# EAGLE design rev1-dragonfly (EAGLE 8.2.2)
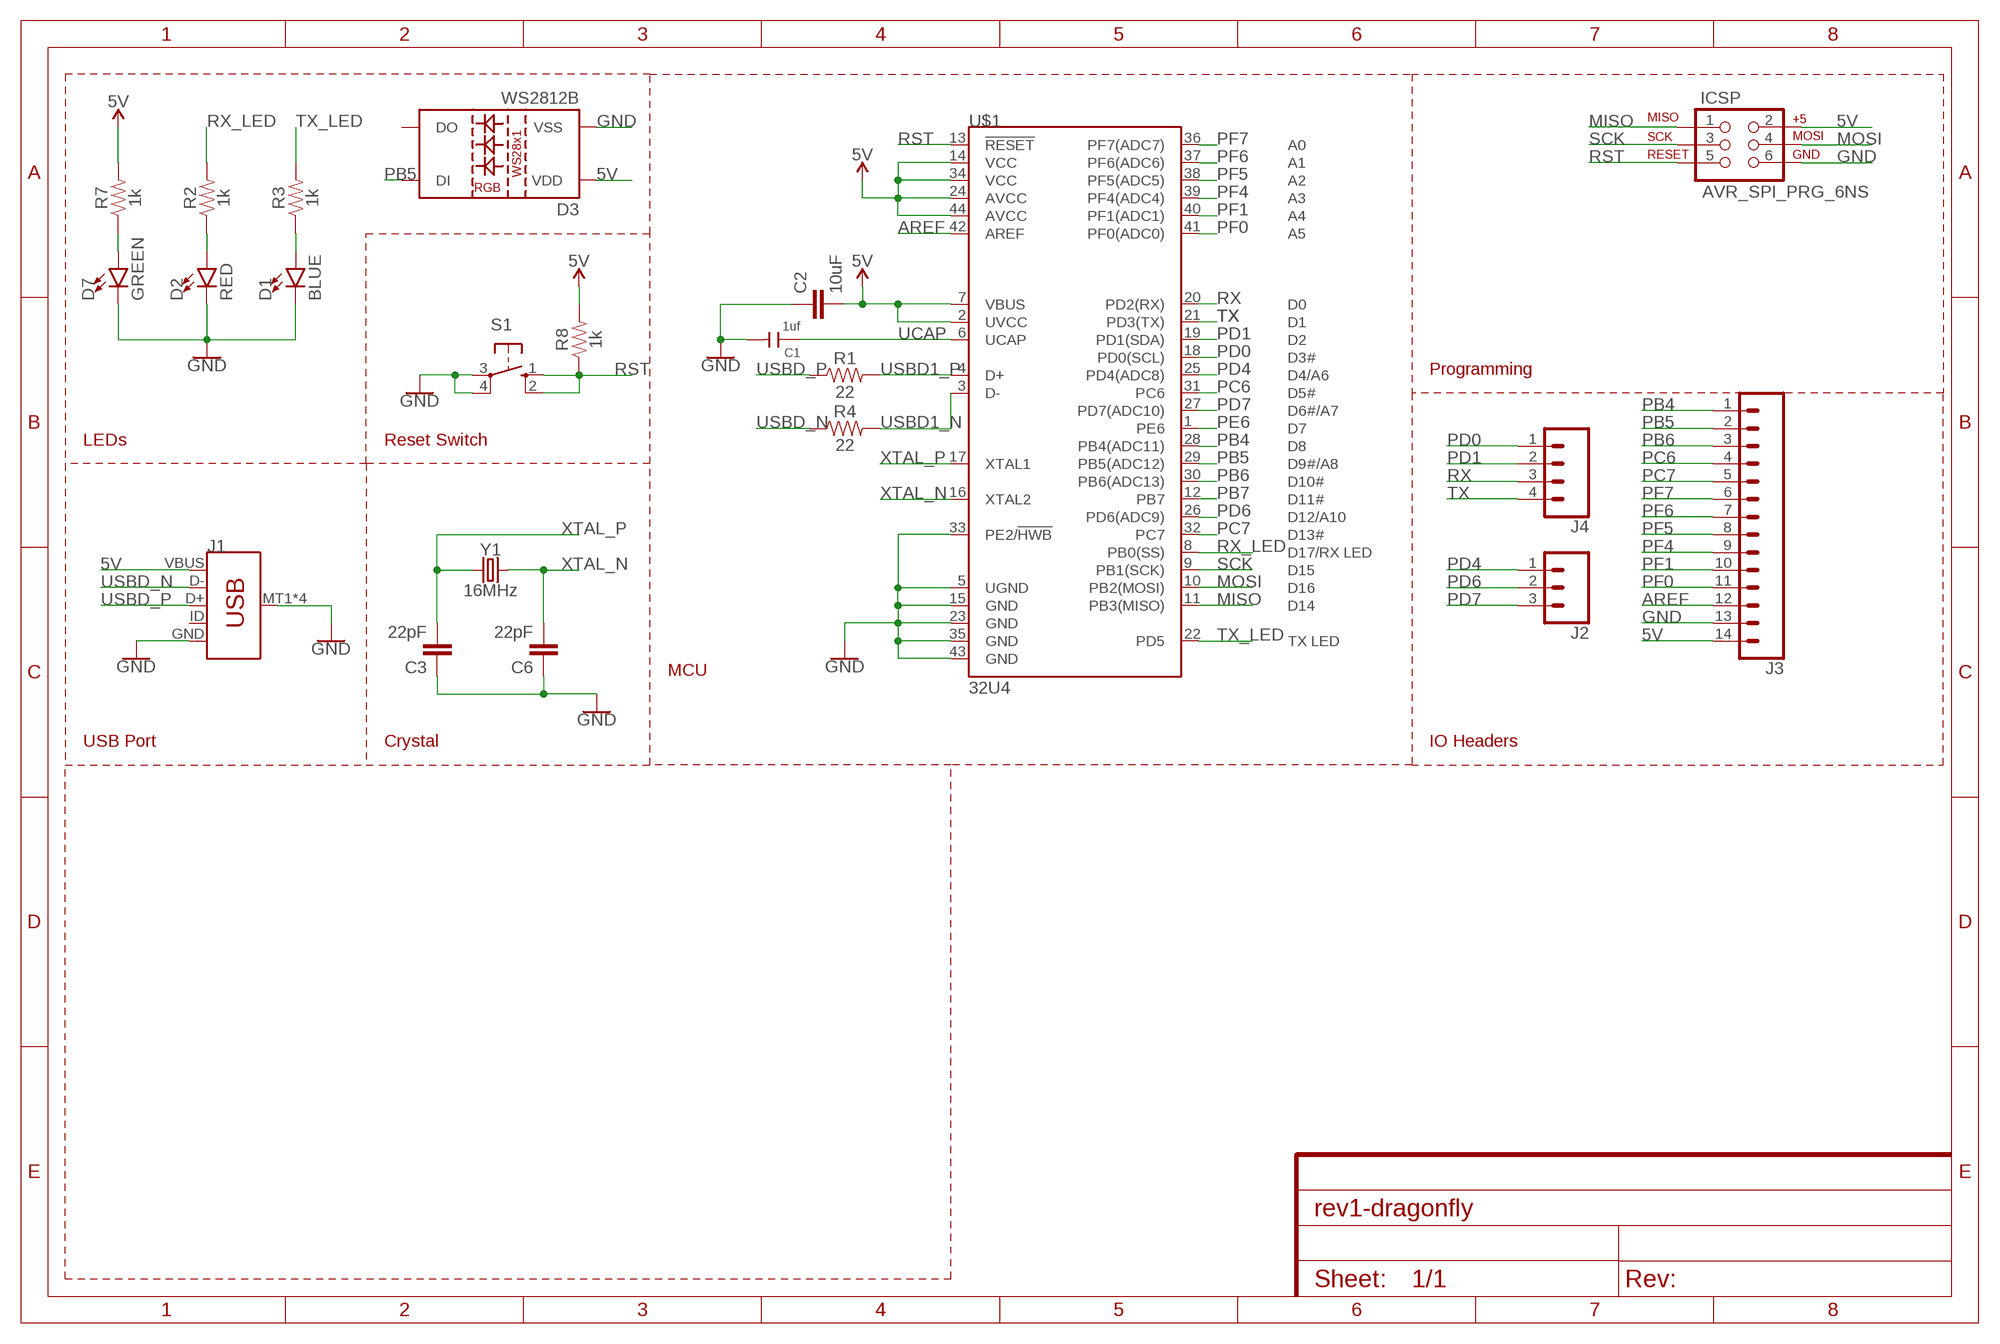
[diagram p0: schematic, sheet 1]

## Parts
C1  1uf  CERAMIC-1UF-25V-10%-X7R(0603)  [C0603]
C2  10uF  10UF-0805-10V-10%  [0805]
C3  22pF  22PF-0603-50V-5%  [0603]
C6  22pF  22PF-0603-50V-5%  [0603]
D1  BLUE  LED-BLUE0603  [LED-0603]
D2  RED  LED-RED0603  [LED-0603]
D3  WS2812B  [WS2812B]
D7  GREEN  LED-GREEN0603  [LED-0603]
ICSP  AVR_SPI_PRG_6NS  [2X3-NS]
J1  USB_MICRO-B_SMT  [USB-MICROB]
J2  CONN_03  [1X03]
J3  CONN_14  [1X14]
J4  CONN_04  [1X04]
R1  22  22OHM-0603-1/10W-1%  [0603]
R2  1k  RESISTOR0805  [0805]
R3  1k  RESISTOR0805  [0805]
R4  22  22OHM-0603-1/10W-1%  [0603]
R7  1k  RESISTOR0805  [0805]
R8  1k  RESISTOR0805  [0805]
S1  10-XX  [B3F-10XX]
U$1  32U4  ATMEGA32U4TQFP-44  [TQFP44]
Y1  16MHz  CRYSTAL-16MHZPTH-HC49US  [HC49US]

## Nets
5V [VCC]: C2.2 D3.1(VDD) ICSP.2 J1.VBUS J3.14 R7.2 R8.2 U$1.2(UVCC) U$1.7(VBUS) U$1.14(VCC) U$1.24(AVCC) U$1.34(VCC) U$1.44(AVCC)
AREF: J3.12 U$1.42(AREF)
GND [GND]: C1.2 C2.1 C3.1 C6.1 D1.C D2.C D3.3(VSS) D7.C ICSP.6 J1.GND J1.MT1(SHIELD) J1.MT2(SHIELD) J1.P$1(SHIELD) J1.P$2(SHIELD) J3.13 S1.3(P) S1.4(P1) U$1.5(UGND) U$1.15(GND) U$1.23(GND) U$1.33(PE2/!HWB) U$1.35(GND) U$1.43(GND)
MISO: ICSP.1 U$1.11(PB3(MISO))
MOSI: ICSP.4 U$1.10(PB2(MOSI))
N$1: D1.A R3.1
N$2: D2.A R2.1
N$3: D7.A R7.1
PB4: J3.1 U$1.28(PB4(ADC11))
PB5: D3.4(DI) J3.2 U$1.29(PB5(ADC12))
PB6: J3.3 U$1.30(PB6(ADC13))
PB7: U$1.12(PB7)
PC6: J3.4 U$1.31(PC6)
PC7: J3.5 U$1.32(PC7)
PD0: J4.1 U$1.18(PD0(SCL))
PD1: J4.2 U$1.19(PD1(SDA))
PD4: J2.1 U$1.25(PD4(ADC8))
PD6: J2.2 U$1.26(PD6(ADC9))
PD7: J2.3 U$1.27(PD7(ADC10))
PE6: U$1.1(PE6)
PF0: J3.11 U$1.41(PF0(ADC0))
PF1: J3.10 U$1.40(PF1(ADC1))
PF4: J3.9 U$1.39(PF4(ADC4))
PF5: J3.8 U$1.38(PF5(ADC5))
PF6: J3.7 U$1.37(PF6(ADC6))
PF7: J3.6 U$1.36(PF7(ADC7))
RST: ICSP.5 R8.1 S1.1(S) S1.2(S1) U$1.13(!RESET)
RX: J4.3 U$1.20(PD2(RX))
RX_LED: R2.2 U$1.8(PB0(SS))
SCK: ICSP.3 U$1.9(PB1(SCK))
TX: J4.4 U$1.21(PD3(TX))
TX_LED: R3.2 U$1.22(PD5)
UCAP: C1.1 U$1.6(UCAP)
USBD1_N: R4.2 U$1.3(D-)
USBD1_P: R1.2 U$1.4(D+)
USBD_N: J1.D- R4.1
USBD_P: J1.D+ R1.1
XTAL_N: C6.2 U$1.16(XTAL2) Y1.2
XTAL_P: C3.2 U$1.17(XTAL1) Y1.1
Unconnected: D3.2(DO) J1.ID

## Notes on the sheet
- Programming
- LEDs | Reset Switch
- MCU
- USB Port | Crystal | IO Headers

## Library data of the parts
C1 = Seeed-Capacitor:CERAMIC-1UF-25V-10%-X7R(0603): 302010139; MPN: CC0603KRX7R8BB105
C2 = SparkFun-Capacitors:10UF: 10.0µF ceramic capacitors A capacitor is a passive two-terminal electrical component used to store electrical energy temporarily in an electric field.; PROD_ID: CAP-11330
C3 C6 = SparkFun-Capacitors:22PF: 22pF ceramic capacitors A capacitor is a passive two-terminal electrical component used to store electrical energy temporarily in an electric field.; PROD_ID: CAP-07876
D1 = SparkFun-LED:LED-BLUE: Blue SMD LED Used in manufacturing of various products at SparkFun Packages: 0603 - SMD 0603 package [Product Link] <http://www.digikey.com/product-detail/en/SMLE12BC7TT86/511-1589-2-ND/1641808> 1206 - SMD1206 package [Product Link] <http://www.digikey.com/product-detail/en/lite-on-inc/LTST-C150TBKT/160-1643-1-ND/573584> SparkFun Products: ESP8266 Thing-Dev Board <https://www.sparkfun.com/products/13711> RedBoard <https://www.sparkfun.com/products/12757>; PROD_ID: DIO-08575
D2 = SparkFun-LED:LED-RED: Red SMD LED Used in manufacturing of most products at SparkFun Packages: 0603 - SMD 0603 package [Product Link] <http://docs.avagotech.com/docs/AV02-0551EN> 0603 SMART - SMD 0603 SMART package ( more efficient and expensive)[Product Link] <http://www.osram-os.com/Graphics/XPic2/00077099_0.pdf> 1206 - SMD1206 package [Product Link] <https://www.sparkfun.com/datasheets/DevTools/LilyPad/Q150OVS4.pdff> SparkFun Products: Pro Mini 328 -5V <https://www.sparkfun.com/products/821> RedBoard <https://www.sparkfun.com/products/12757> IOIO-OTG <https://www.sparkfun.com/products/13613>; PROD_ID: DIO-00819
D3 = SparkFun-LED:WS2812B: WS2812B SMD addressable RGB LED 5x5mm SMD LED with built-in controller IC. Color: Red/Green/Blue mC Rating: RGB: 390, 660, 180 mcd Forward Voltage: RGB: 2.0, 3.0, 3.0 V Packages:WS2812B SparkFun Products: Blynk Board - ESP8266 <https://www.sparkfun.com/products/13794>; PROD_ID: DIO-12503
D7 = SparkFun-LED:LED-GREEN: Green SMD LED Used in manufacturing of various products at SparkFun Packages: 0603 - SMD 0603 package [Product Link] <http://www.futureelectronics.com/en/technologies/semiconductors/optoelectronics/leds/Pages/9894312-LTST-C190GKT.aspx?CrossPart=HSMG-C190&IM=0> LilyPad 1206 - SMD1206 LilyPad package [Product Link] <http://www.futureelectronics.com/en/Technologies/Product.aspx?ProductID=IN150NGHARVATEKCORPORATION2049943&IM=0> 1206 - SMD1206 package [Product Link] <http://www.futureelectronics.com/en/technologies/semiconductors/optoelectronics/leds/Pages/8315665-LTST-C150KGKT.aspx?IM=0> 1206 Bottom Mount -SMD 1206 Bottom Mount [Product Link] <http://www.digikey.com/product-detail/en/lite-on-inc/LTST-C230KGKT/160-1456-1-ND/386854> SparkFun Products: Pro Mini 328 -5V <https://www.sparkfun.com/products/821> RedBoard <https://www.sparkfun.com/products/12757> MP3 Trigger <https://www.sparkfun.com/products/13720> Makey Makey <https://www.sparkfun.com/products/11076>; PROD_ID: DIO-00821
ICSP = SparkFun-Connectors:AVR_SPI_PRG_6: AVR ISP 6 Pin This is the reduced ISP connector for AVR programming. Common on Arduino. This footprint will take up less PCB space and can be used with a 10-pin to 6-pin adapter such as SKU: BOB-08508 **Special note about "TEST_POINT" package. The stop mask is on the top side, so if you want your programming test points to be on the bottom of your board, make sure to place this package on the bottom side of the board. This also ensure that the orientation to program from the bottom side will be correct.
J1 = SparkFun-Connectors:USB_MICRO-B: USB Type Micro-B Connector Male/female and PTH/SMT variants SparkFun Products: SparkFun microB USB Breakout <https://www.sparkfun.com/products/12035> SparkFun USB microB Plug Breakout <https://www.sparkfun.com/products/10031> SparkFun ESP8266 Thing <https://www.sparkfun.com/products/13231>; PROD_ID: CONN-09505; SF_ID: PRT-08533
J2 = SparkFun-Connectors:CONN_03: Multi connection point. Often used as Generic Header-pin footprint for 0.1 inch spaced/style header connections On any of the 0.1 inch spaced packages, you can populate with these: Break Away Headers - Straight <https://www.sparkfun.com/products/116> (PRT-00116) Break Away Male Headers - Right Angle <https://www.sparkfun.com/products/553> (PRT-00553) Female Headers <https://www.sparkfun.com/products/115> (PRT-00115) Break Away Headers - Machine Pin <https://www.sparkfun.com/products/117> (PRT-00117) Break Away Female Headers - Swiss Machine Pin <https://www.sparkfun.com/products/743> (PRT-00743) Stackable Header - 3 Pin (Female, 0.1") <https://www.sparkfun.com/products/13875> (PRT-13875) For SCREWTERMINALS and SPRING TERMINALS visit here: Screw Terimnals on SparkFun.com <https://www.sparkfun.com/search/results?term=Screw+Terminals> (5mm/3.5mm/2.54mm spacing) This device is also useful as a general connection point to wire up your design to another part of your project. Our various solder wires solder well into these plated through hole pads. Hook-Up Wire - Assortment (Stranded, 22 AWG) <https://www.sparkfun.com/products/11375> (PRT-11375) Hook-Up Wire - Assortment (Solid Core, 22 AWG) <https://www.sparkfun.com/products/11367> (PRT-11367) View the entire wire category on our website here <https://www.sparkfun.com/categories/141> Special notes: Molex polarized connector foot print use with SKU : PRT-08232 with associated crimp pins and housings.
J3 = SparkFun-Connectors:CONN_14: Multi connection point. Often used as Generic Header-pin footprint for 0.1 inch spaced/style header connections On any of the 0.1 inch spaced packages, you can populate with these: Break Away Headers - Straight <https://www.sparkfun.com/products/116> (PRT-00116) Break Away Male Headers - Right Angle <https://www.sparkfun.com/products/553> (PRT-00553) Female Headers <https://www.sparkfun.com/products/115> (PRT-00115) Break Away Headers - Machine Pin <https://www.sparkfun.com/products/117> (PRT-00117) Break Away Female Headers - Swiss Machine Pin <https://www.sparkfun.com/products/743> (PRT-00743) For SCREWTERMINALS and SPRING TERMINALS visit here: Screw Terimnals on SparkFun.com <https://www.sparkfun.com/search/results?term=Screw+Terminals> (5mm/3.5mm/2.54mm spacing) This device is also useful as a general connection point to wire up your design to another part of your project. Our various solder wires solder well into these plated through hole pads. Hook-Up Wire - Assortment (Stranded, 22 AWG) <https://www.sparkfun.com/products/11375> (PRT-11375) Hook-Up Wire - Assortment (Solid Core, 22 AWG) <https://www.sparkfun.com/products/11367> (PRT-11367) View the entire wire category on our website here <https://www.sparkfun.com/categories/141> Special notes: Molex polarized connector foot print use with SKU : PRT-08231 with associated crimp pins and housings. 1MM SMD Version SKU: PRT-10208 NOTES ON THE VARIANTS LOCK and LOCK_LONGPADS... This footprint was designed to help hold the alignment of a through-hole component (i.e. 6-pin header) while soldering it into place. You may notice that each hole has been shifted either up or down by 0.005 of an inch from it's more standard position (which is a perfectly straight line). This slight alteration caused the pins (the squares in the middle) to touch the edges of the holes. Because they are alternating, it causes a "brace" to hold the component in place. 0.005 has proven to be the perfect amount of "off-center" position when using our standard breakaway headers. Although looks a little odd when you look at the bare footprint, once you have a header in there, the alteration is very hard to notice. Also,if you push a header all the way into place, it is covered up entirely on the bottom side.
J4 = SparkFun-Connectors:CONN_04: Multi connection point. Often used as Generic Header-pin footprint for 0.1 inch spaced/style header connections On any of the 0.1 inch spaced packages, you can populate with these: Break Away Headers - Straight <https://www.sparkfun.com/products/116> (PRT-00116) Break Away Male Headers - Right Angle <https://www.sparkfun.com/products/553> (PRT-00553) Female Headers <https://www.sparkfun.com/products/115> (PRT-00115) Break Away Headers - Machine Pin <https://www.sparkfun.com/products/117> (PRT-00117) Break Away Female Headers - Swiss Machine Pin <https://www.sparkfun.com/products/743> (PRT-00743) For SCREWTERMINALS and SPRING TERMINALS visit here: Screw Terimnals on SparkFun.com <https://www.sparkfun.com/search/results?term=Screw+Terminals> (5mm/3.5mm/2.54mm spacing) This device is also useful as a general connection point to wire up your design to another part of your project. Our various solder wires solder well into these plated through hole pads. Hook-Up Wire - Assortment (Stranded, 22 AWG) <https://www.sparkfun.com/products/11375> (PRT-11375) Hook-Up Wire - Assortment (Solid Core, 22 AWG) <https://www.sparkfun.com/products/11367> (PRT-11367) View the entire wire category on our website here <https://www.sparkfun.com/categories/141> Special notes: Molex polarized connector foot print use with SKU : PRT-08231 with associated crimp pins and housings. 1MM SMD Version SKU: PRT-10208; PROD_ID: CONN-09696
R1 R4 = SparkFun-Resistors:22OHM: 22Ω resistor A resistor is a passive two-terminal electrical component that implements electrical resistance as a circuit element. Resistors act to reduce current flow, and, at the same time, act to lower voltage levels within circuits. - Wikipedia; PROD_ID: RES-08698
R2 R3 R7 R8 = SparkFun-Resistors:RESISTOR: Generic Resistor Package
S1 = switch-omron:10-XX: OMRON SWITCH; MPN: B3F-1000; OC_FARNELL: 176432; OC_NEWARK: 36M3542
U$1 = SparkFun-IC-Microcontroller:ATMEGA32U4: Atmel MCU, 32KByte Atmel 44-pin 8-bit Microcontroller with 32KBytes of ISP Flash and USB Controller Datasheet <http://cdn.sparkfun.com/datasheets/Dev/Arduino/Boards/ATMega32U4.pdf> SparkFun Products LilyPad Arduino USB - ATmega32U4 Board <https://www.sparkfun.com/products/12049> (DEV-12049) Pro Micro - 5V/16MHz <https://www.sparkfun.com/products/12640> (DEV-12640) Pro Micro - 3.3V/8MHz <https://www.sparkfun.com/products/12587> (DEV-12587) Fio v3 - ATmega32U4 <https://www.sparkfun.com/products/11520> (DEV-11520) Qduino Mini <https://www.sparkfun.com/products/13614> (DEV-13614) Makey Makey - Standard Kit <https://www.sparkfun.com/products/11511> (WIG-11511) Makey Makey Deluxe Kit <https://www.sparkfun.com/products/11519> (WIG-11519); PROD_ID: IC-11161
Y1 = SparkFun-Clocks:CRYSTAL-16MHZ: 16MHz Crystal Digikey Example <http://www.digikey.com/product-search/en?keywords=535-9122-1-ND> Frequency: 16MHz Frequency Stability: ±50ppm Frequency Tolerance: ±20ppm Load Capacitance: 18pF SparkFun Products: Pro Micro -5V/16MHz <https://www.sparkfun.com/products/12640> SparkFun Serial Enabled LCD Kit <https://www.sparkfun.com/products/10097>; PROD_ID: XTAL-08181; SF_ID: COM-00536

## Net classes
1 GND: width 0.254 mm
2 VBAT: width 0.254 mm
3 VCC: width 0.254 mm

## Board
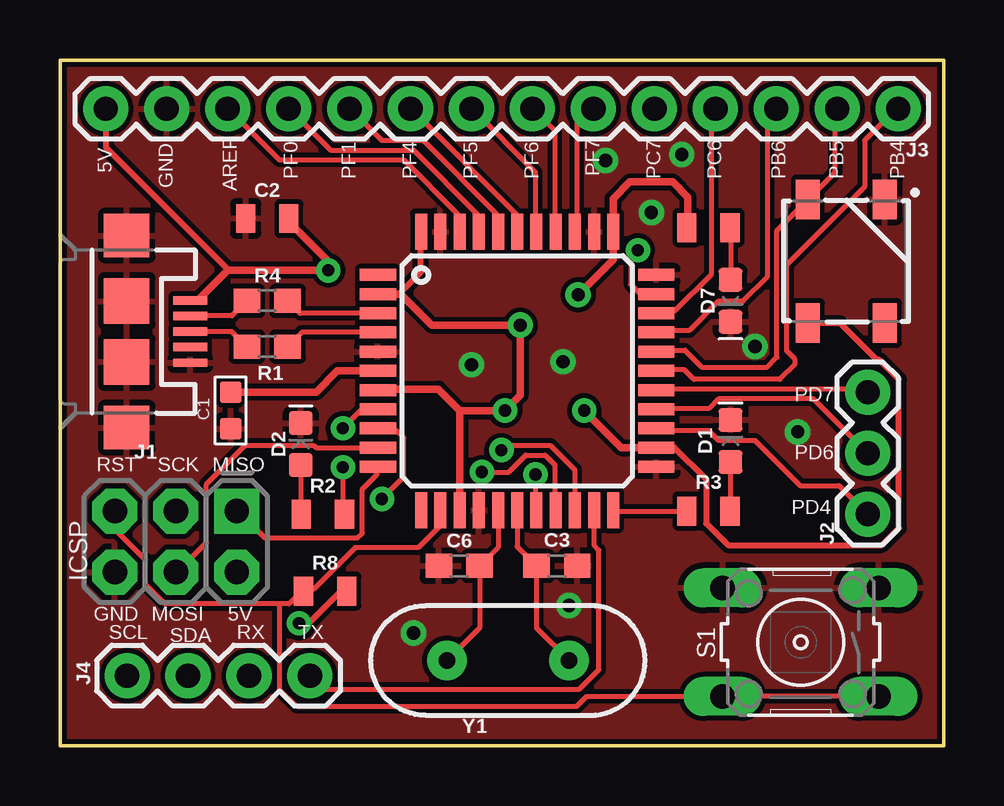
[diagram p1: board, top side]
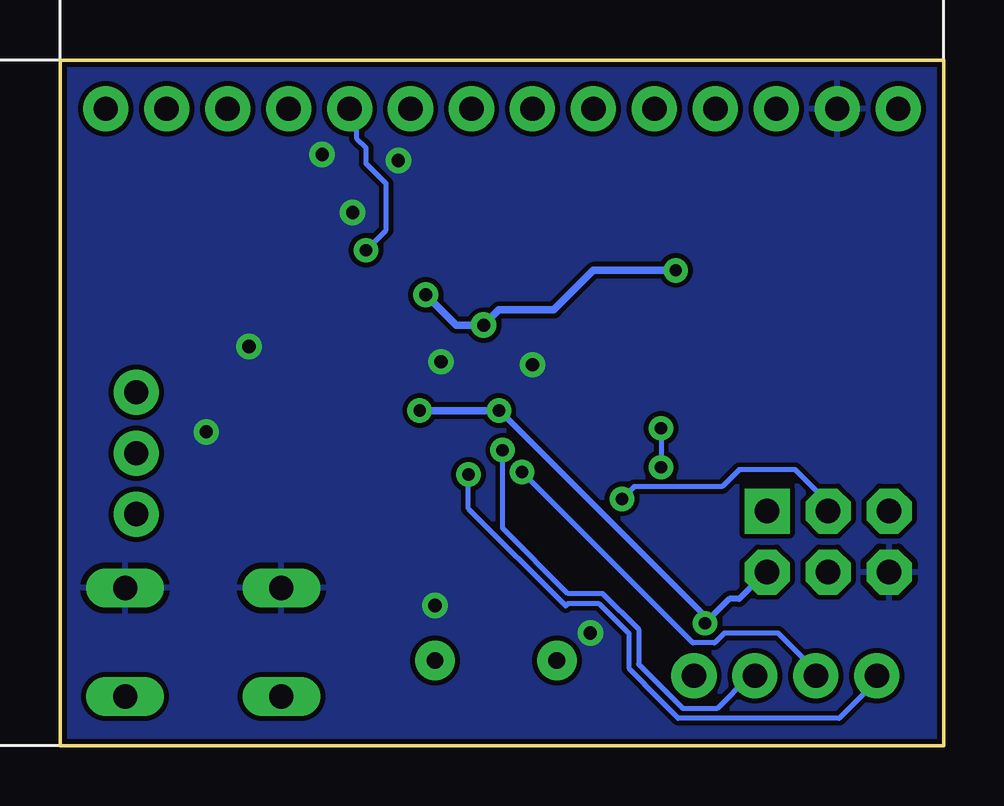
[diagram p2: board, bottom side, seen from below]

Size 36.83 x 28.57 mm. Coordinates in mm from the lower left corner, seen from the top.
Outline: 0,0 0,28.58 36.83,28.58 36.83,0 0,0
Copper layers (1*16): Top 0.035mm / dielectric 1.5mm / Bottom 0.035mm
Design rules "SparkFun": minimum track width 8mil, minimum drill 20mil, track to track 8mil, track to pad 8mil, pad to pad 8mil, via to via 8mil, smd to smd 8mil, copper to edge 8mil, drill to drill 8mil, minimum pad ring 12mil, minimum via ring 10mil, stop-mask expansion 4mil, vias tented up to drill 20mil, thermal gap 10mil

### Footprints (pad centres in the part's own frame; a part is rotated, then mirrored left to right if it is on the bottom)
C0603 = smd 0.889 x 0.889: 1 0,0.762; 2 0,-0.762
0805 = smd 0.8 x 1.2: 1 -0.9,0; 2 0.9,0
0603 = smd 1.1 x 1: 1 -0.85,0; 2 0.85,0
LED-0603 = smd 1 x 1: A -0.877,0; C 0.877,0
WS2812B = smd 1.651 x 1: 1 2.577,-1.6; 2 2.577,1.6; 3 -2.577,1.6; 4 -2.577,-1.6
2X3-NS = drill 1.016 pad 1.88 square: 1 -2.54,-1.27 | drill 1.016 pad 1.88 octagon: 2 -2.54,1.27; 3 0,-1.27; 4 0,1.27; 5 2.54,-1.27; 6 2.54,1.27
USB-MICROB = smd 1.4 x 0.35: D+ -2.65,0; D- -2.65,-0.65; GND -2.65,1.3; ID -2.65,0.65; VBUS -2.65,-1.3 | smd 1.9 x 1.8: MT1 0,-4; MT2 0,4 | smd 1.9 x 1.9: P$1 0,-1.27; P$2 0,1.27
1X03 = drill 1.016 pad 1.88: 1 0,0; 2 2.54,0; 3 5.08,0
1X14 = drill 1.016 pad 1.88: 1 0,0; 2 2.54,0; 3 5.08,0; 4 7.62,0; 5 10.16,0; 6 12.7,0; 7 15.24,0; 8 17.78,0; 9 20.32,0; 10 22.86,0; 11 25.4,0; 12 27.94,0; 13 30.48,0; 14 33.02,0
1X04 = drill 1.016 pad 1.88: 1 0,0; 2 2.54,0; 3 5.08,0; 4 7.62,0
B3F-10XX = drill 1.016 long: 1 -3.251,2.261; 2 3.251,2.261; 3 -3.251,-2.261; 4 3.251,-2.261
TQFP44 = smd 1.5 x 0.5: 1 -5.8,4; 2 -5.8,3.2; 3 -5.8,2.4; 4 -5.8,1.6; 5 -5.8,0.8; 6 -5.8,0; 7 -5.8,-0.8; 8 -5.8,-1.6; 9 -5.8,-2.4; 10 -5.8,-3.2; 11 -5.8,-4; 23 5.8,-4; 24 5.8,-3.2; 25 5.8,-2.4; 26 5.8,-1.6; 27 5.8,-0.8; 28 5.8,0; 29 5.8,0.8; 30 5.8,1.6; 31 5.8,2.4; 32 5.8,3.2; 33 5.8,4 | smd 0.5 x 1.5: 12 -4,-5.8; 13 -3.2,-5.8; 14 -2.4,-5.8; 15 -1.6,-5.8; 16 -0.8,-5.8; 17 0,-5.8; 18 0.8,-5.8; 19 1.6,-5.8; 20 2.4,-5.8; 21 3.2,-5.8; 22 4,-5.8; 34 4,5.8; 35 3.2,5.8; 36 2.4,5.8; 37 1.6,5.8; 38 0.8,5.8; 39 0,5.8; 40 -0.8,5.8; 41 -1.6,5.8; 42 -2.4,5.8; 43 -3.2,5.8; 44 -4,5.8
HC49US = drill 0.7 pad 1.651: 1 -2.54,0; 2 2.54,0

### Placement (x,y rotation side)
C1  7.11,13.97 0 top
C2  8.64,21.97 0 top
C3  20.7,7.49 180 top
C6  16.64,7.49 0 top
D1  27.94,12.7 90 top
D2  10.03,12.57 90 top
D3  32.77,20.19 270 top
D7  27.94,18.54 270 top
ICSP  4.83,8.51 180 top
J1  2.78,17.26 180 top
J2  33.66,9.65 90 top
J3  34.93,26.54 180 top
J4  2.79,2.92 0 top
R1  8.64,16.64 0 top
R2  10.95,9.65 0 top
R3  27.02,9.78 180 top
R4  8.64,18.54 0 top
R7  27.02,21.59 180 top
R8  11.05,6.45 0 top
S1  30.86,4.32 180 top
U$1  19.05,15.62 0 top
Y1  18.67,3.56 180 top

### Tracks (layer width: path | path; a pad name or v marks a point on that pad's centre or on a via)
5V  (via drill 0.51, 0.55)
  Top 0.254: v9.96,5.11 10.36,5.11 11.68,6.43 11.89,6.43 R8.2 | C2.2 9.54,21.83 | 13.31,14.86 U$1.7 | U$1.44 15.04,21.36 15.04,19.74 14.22,18.92 14.2,18.82 | D3.1 31.19,17.6 32.51,17.6 34.04,16.08 34.14,16.08 34.95,15.27 34.95,9.07 34.24,8.36 27.84,8.36 26.92,9.27 26.92,11.1 25.6,12.42 24.99,12.42 U$1.24 | J3.14 1.93,26.54 1.93,24.92 6.91,19.94 6.98,19.81
  Top 0.305: J1.VBUS 5.74,18.57 6.98,19.81 v11.18,19.81 11.18,20.19 9.54,21.83 | 16.65,13.97 U$1.14 | 24.82,12.45 U$1.24 23.39,12.42 v21.84,13.97 | v18.54,13.97 | 16.65,13.97 v18.54,13.97 | U$1.2 14.2,18.82 15.49,17.53 v19.18,17.53 19.18,14.61 v18.54,13.97 | 16.65,13.97 15.76,14.86 13.31,14.86 13.29,14.86 | v21.59,18.8 23.05,20.26 U$1.34 23.05,22.8 23.75,23.5 25.53,23.5 26.16,22.86 26.16,21.63 R7.2
  Bottom 0.254: ICSP.2 7.42,7.24 8.53,6.12 8.94,6.12 v9.96,5.11 9.85,5.31 18.49,13.94 v18.54,13.97
  Bottom 0.305: v11.18,19.81 14.6,19.81 16.26,18.16 18.54,18.16 v19.18,17.53 20.32,17.53 v21.59,18.8 | v18.54,13.97 v21.84,13.97
AREF
  Top 0.203: U$1.42 16.56,21.46 16.56,22.17 14.33,24.41 9.14,24.41 7.01,26.54 J3.12
GND  (via drill 0.55)
  other vias: 21.21,5.84 14.73,4.7 20.96,16 17.15,15.88 30.73,13.08 22.73,24.38 28.96,16.64 24.64,22.22 25.91,24.64
  pour Top: 36.45,0.38 0.38,0.38 0.38,28.19 36.45,28.19
  pour Bottom: 0.38,28.19 36.45,28.19 36.45,0.38 0.38,0.38
MISO
  Top 0.203: U$1.11 13.21,11.61 13.21,11.3 12.6,10.69 12.6,8.86 12.39,8.66 8.53,8.66 7.42,9.78 ICSP.1
MOSI
  Top 0.203: U$1.10 13.21,12.42 10.67,12.42 10.57,12.52 7.72,12.52 6.1,10.9 6.1,8.46 4.88,7.24 ICSP.4
N$1
  Top 0.203: D1.A 27.94,9.78 R3.1
N$2
  Top 0.203: D2.A 10.06,11.61 10.06,9.68 R2.1
N$3
  Top 0.203: D7.A 27.94,21.56 R7.1
PB4
  Top 0.203: U$1.28 24.89,15.67 26.01,15.67 26.42,15.27 30,15.27 30.61,15.88 30.61,16.13 30.28,16.46 30.28,20.04 33.53,23.29 33.53,25.22 34.85,26.54 J3.1
PB5
  Top 0.203: U$1.29 24.89,16.48 26.03,16.48 26.75,15.77 29.46,15.77 29.87,16.18 29.87,21.46 31.09,22.68 D3.4 31.19,22.78 32.31,23.9 32.31,26.54 J3.2
PB6
  Top 0.203: U$1.30 24.89,17.3 26.21,17.3 27.43,18.52 28.45,18.52 29.46,19.53 29.46,26.24 29.77,26.54 J3.3
PC6
  Top 0.203: U$1.31 24.89,18.11 25.6,18.11 27.13,19.63 27.13,26.44 27.23,26.54 J3.4
PC7  (via drill 0.51)
  Top 0.203: v24.08,20.65 23.77,20.35 23.77,19.23 24.18,18.82 24.79,18.82 U$1.32
  Bottom 0.203: J3.5 24.69,26.54 24.69,25.83 24.49,25.63 24.49,25.32 24.08,24.92 24.08,24.26 23.24,23.42 23.24,21.49 v24.08,20.65
PD0  (via drill 0.51)
  Top 0.203: v19.81,11.3 19.81,9.88 U$1.18
  Bottom 0.203: v19.81,11.3 19.81,9.88 15.76,5.83 15.65,5.94 14.38,5.94 13.13,4.68 13.13,3.24 12.47,2.57 12.47,2.54 11.07,1.14 4.37,1.14 2.84,2.67 2.84,2.87 J4.1
PD1  (via drill 0.51)
  Top 0.203: v17.58,11.4 18.69,11.4 19.41,12.12 20.22,12.12 20.62,11.71 20.62,9.88 U$1.19
  Bottom 0.203: v17.58,11.4 10.46,4.29 9.55,4.29 9.14,4.7 6.91,4.7 5.38,3.18 5.38,2.97 J4.2
PD4
  Top 0.203: J2.1 32.46,10.85 30.84,10.85 28.96,12.73 27.43,12.73 27.03,13.13 24.89,13.13 U$1.25
PD6
  Top 0.203: J2.2 31.39,14.45 27.43,14.45 27.03,14.05 24.89,14.05 U$1.26
PD7
  Top 0.203: J2.3 33.53,14.86 24.89,14.86 U$1.27
PF0
  Top 0.203: U$1.41 17.37,21.46 17.37,22.17 14.73,24.82 11.28,24.82 9.55,26.54 J3.11
PF1
  Top 0.203: U$1.40 18.19,21.46 18.19,22.17 15.14,25.22 13.41,25.22 12.09,26.54 J3.10
PF4
  Top 0.203: U$1.39 19,21.46 19,22.17 14.63,26.54 J3.9
PF5
  Top 0.203: U$1.38 19.81,21.46 19.81,23.9 17.17,26.54 J3.8
PF6
  Top 0.203: U$1.37 20.62,21.46 20.62,25.63 19.71,26.54 J3.7
PF7
  Top 0.203: U$1.36 21.54,21.46 21.54,25.93 22.15,26.54 J3.6
RST
  Top 0.203: S1.1 S1.2 21.95,2.06 21.54,1.65 9.85,1.65 9.14,2.36 9.14,5.92 | U$1.13 15.85,9.78 15.85,9.17 14.93,8.26 12.29,8.26 10.57,6.53 10.16,6.53 R8.1 10.06,6.43 9.55,5.92 9.14,5.92 | 9.14,5.92 4.37,5.92 3.56,6.73 3.56,7.75 2.34,8.97 2.34,9.78 ICSP.5
RX  (via drill 0.51)
  Top 0.203: v18.39,12.32 18.59,12.52 20.42,12.52 21.44,11.51 21.44,9.88 U$1.20
  Bottom 0.203: v18.39,12.32 18.39,9.07 15.67,6.34 14.22,6.34 12.7,4.83 12.7,3.43 12.73,3.4 10.87,1.55 9.45,1.55 8.13,2.87 7.92,2.87 J4.3
RX_LED  (via drill 0.51)
  Top 0.203: v11.79,11.61 11.79,9.68 R2.2 | v11.79,13.23 12.5,13.94 13.21,13.94 U$1.8
  Bottom 0.203: v11.79,13.23 v11.79,11.61
SCK  (via drill 0.51)
  Top 0.203: v13.41,10.29 14.33,11.2 14.33,12.83 14.02,13.13 13.31,13.13 U$1.9
  Bottom 0.203: v13.41,10.29 12.9,10.8 9.25,10.8 8.53,11.51 6.2,11.51 4.88,10.19 4.88,9.78 ICSP.3
TX
  Top 0.203: J4.4 10.97,2.36 21.64,2.36 22.45,3.18 22.45,8.15 22.25,8.36 22.25,9.78 U$1.21
TX_LED
  Top 0.203: R3.2 23.06,9.78 U$1.22
UCAP
  Top 0.305: U$1.6 11.56,15.62 10.67,14.73 C1.1
USBD1_N
  Top 0.203: U$1.3 10.01,18.02 R4.2
USBD1_P
  Top 0.203: U$1.4 10.07,17.22 R1.2
USBD_N
  Top 0.203: R4.1 7.16,17.91 J1.D-
USBD_P
  Top 0.203: R1.1 7.16,17.26 J1.D+
XTAL_N
  Top 0.203: U$1.16 18.25,8.26 C6.2 17.49,4.91 Y1.2
XTAL_P
  Top 0.203: U$1.17 19.05,8.29 C3.2 19.85,4.91 Y1.1

### Text on the board
tPlace: 5V | PF0 | PF1 | PF4 | PF5 | PF6 | PF7 | PC7 | PC6 | PB6 | PB5 | PB4 | GND | AREF | PD7 | PD6 | RST | SCK | MISO | PD4 | GND | MOSI | 5V | SCL | SDA | RX | TX